# EAGLE design TinkerAccess RGB LED Driver (EAGLE 9.6.2)
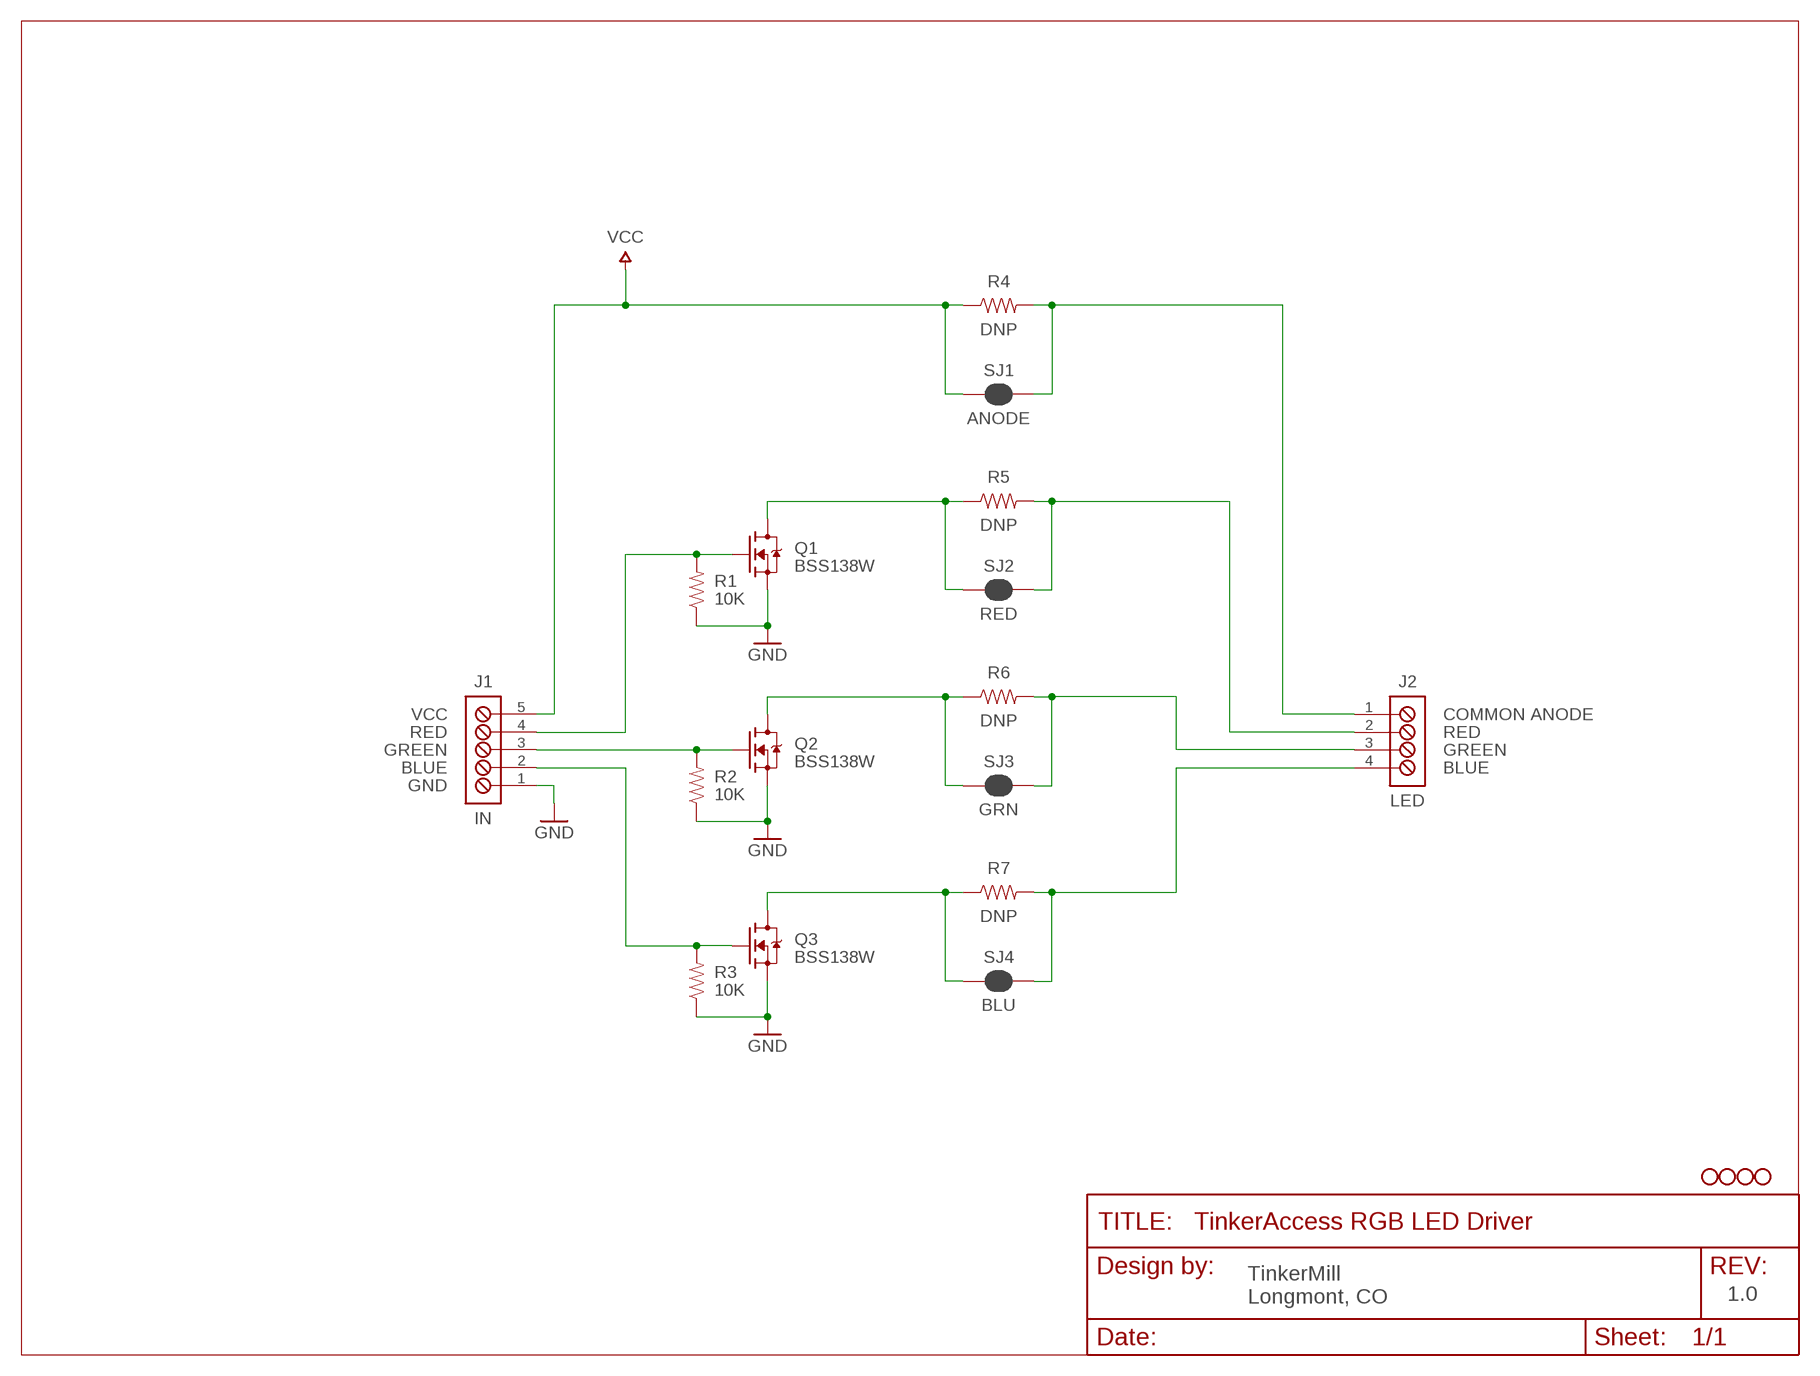
[diagram p0: schematic, sheet 1]

## Parts
J1  IN  TB_5X1_ON_SHORE_OSTVN05A150  [ON_SHORE_OSTVN05A150]
J2  LED  TB_4X1_ON_SHORE_OSTVN04A150  [ON_SHORE_OSTVN04A150]
Q1  BSS138W  N_MOSFET_BSS138W  [SOT323]
Q2  BSS138W  N_MOSFET_BSS138W  [SOT323]
Q3  BSS138W  N_MOSFET_BSS138W  [SOT323]
R1  10K  RESISTOR_0603  [0603]
R2  10K  RESISTOR_0603  [0603]
R3  10K  RESISTOR_0603  [0603]
R4  DNP  RESISTOR_0603  [0603]
R5  DNP  RESISTOR_0603  [0603]
R6  DNP  RESISTOR_0603  [0603]
R7  DNP  RESISTOR_0603  [0603]
SJ1  ANODE  JMP_PAD_2X1_CLOSED_BY_PASTE_NORMAL  [JMP_PAD_2X1_CLOSED_BY_PASTE]
SJ2  RED  JMP_PAD_2X1_CLOSED_BY_PASTE_NORMAL  [JMP_PAD_2X1_CLOSED_BY_PASTE]
SJ3  GRN  JMP_PAD_2X1_CLOSED_BY_PASTE_NORMAL  [JMP_PAD_2X1_CLOSED_BY_PASTE]
SJ4  BLU  JMP_PAD_2X1_CLOSED_BY_PASTE_NORMAL  [JMP_PAD_2X1_CLOSED_BY_PASTE]
STANDOFF1  STANDOFF_2.3MM_NO_CU  [STANDOFF_2.3MM_NO_CU]
STANDOFF2  STANDOFF_2.3MM_NO_CU  [STANDOFF_2.3MM_NO_CU]
STANDOFF3  STANDOFF_2.3MM_NO_CU  [STANDOFF_2.3MM_NO_CU]
STANDOFF4  STANDOFF_2.3MM_NO_CU  [STANDOFF_2.3MM_NO_CU]

## Nets
GND: J1.1 Q1.2(S) Q2.2(S) Q3.2(S) R1.1 R2.1 R3.1
N$1: J1.4 Q1.1(G) R1.2
N$2: J1.3 Q2.1(G) R2.2
N$3: J1.2 Q3.1(G) R3.2
N$4: J2.2 R5.2 SJ2.2
N$5: J2.3 R6.2 SJ3.2
N$6: J2.4 R7.2 SJ4.2
N$8: Q1.3(D) R5.1 SJ2.1
N$9: Q2.3(D) R6.1 SJ3.1
N$10: Q3.3(D) R7.1 SJ4.1
N$13: J2.1 R4.2 SJ1.2
VCC: J1.5 R4.1 SJ1.1

## Notes on the sheet
- VCC | COMMON ANODE
- RED | RED
- GREEN | GREEN
- BLUE | BLUE
- GND
- TinkerMill
  Longmont, CO
- 1.0

## Library data of the parts
J1 = TMF_Connectors:TB_5X1
J2 = TMF_Connectors:TB_4X1
Q1-Q3 = TMF_Discretes:N_MOSFET
R1-R7 = TMF_Resistors:RESISTOR
SJ1-SJ4 = TMF_Connectors:JMP_PAD_2X1_CLOSED_BY_PASTE
STANDOFF1-STANDOFF4 = TMF_Hardware:STANDOFF

## Board
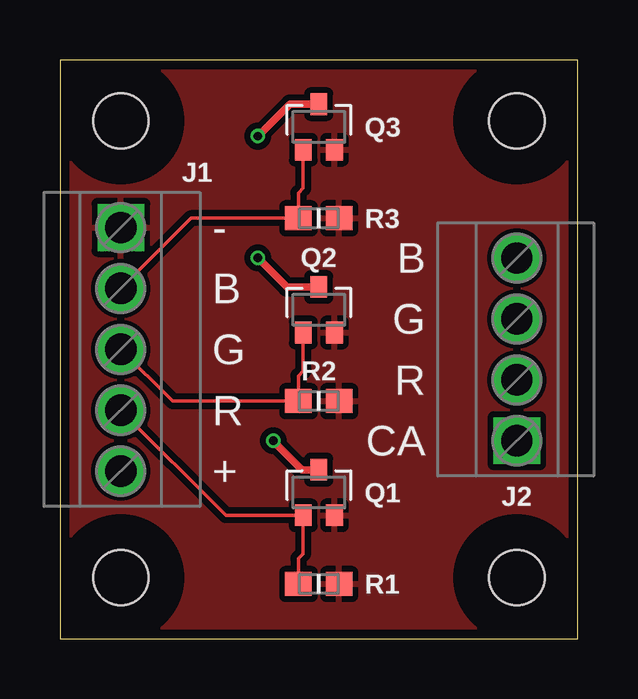
[diagram p1: board, top side]
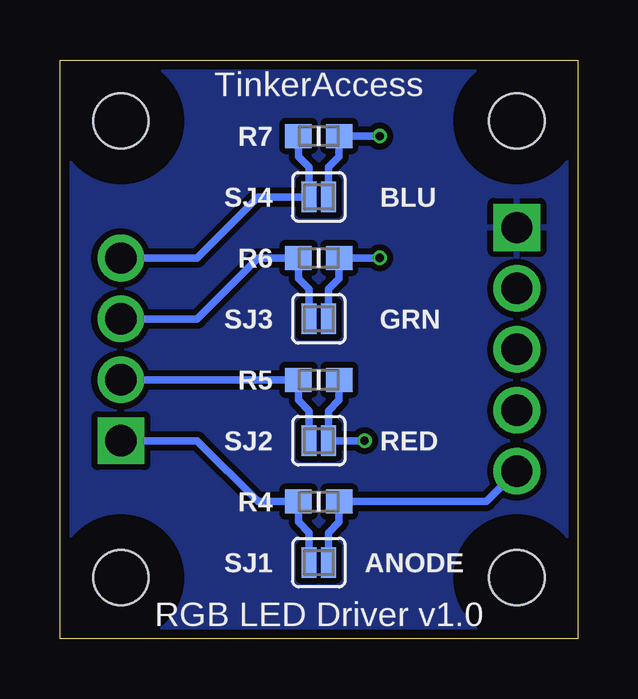
[diagram p2: board, bottom side, seen from below]

Size 21.59 x 24.13 mm. Coordinates in mm from the lower left corner, seen from the top.
Outline: 0,0 21.59,0 21.59,24.13 0,24.13 0,0
Copper layers (1*16): Top 0.035559375mm / dielectric 1.6mm / Bottom 0.035559375mm
Design rules "oshpark-2layer-tented": minimum track width 6mil, minimum drill 10mil, track to track 6mil, track to pad 6mil, pad to pad 6mil, via to via 6mil, smd to smd 6mil, copper to edge 15mil, drill to drill 6mil, minimum pad ring 5mil, minimum via ring 5mil, stop-mask expansion 2.5mil, vias tented up to drill 20mil, thermal gap 10mil

### Footprints (pad centres in the part's own frame; a part is rotated, then mirrored left to right if it is on the bottom)
ON_SHORE_OSTVN05A150 = drill 1.3 square: 1 0,5.08 | drill 1.3: 2 0,2.54; 3 0,0; 4 0,-2.54; 5 0,-5.08
ON_SHORE_OSTVN04A150 = drill 1.3 square: 1 0,3.81 | drill 1.3: 2 0,1.27; 3 0,-1.27; 4 0,-3.81
SOT323 = smd 0.7 x 0.9: 1 -0.65,-0.95; 2 0.65,-0.95; 3 0,0.95
0603 = smd 1.1 x 1: 1 -0.85,0; 2 0.85,0
JMP_PAD_2X1_CLOSED_BY_PASTE = smd 0.635 x 1.27: 1 -0.406,0; 2 0.406,0
STANDOFF_2.3MM_NO_CU = hole 2.3: 0,0

### Placement (x,y rotation side)
J1  2.54,12.06 0 top
J2  19.05,12.06 180 top
Q1  10.79,6.1 0 top
Q2  10.79,13.72 0 top
Q3  10.79,21.34 0 top
R1  10.79,2.29 180 top
R2  10.79,9.91 180 top
R3  10.79,17.53 180 top
R4  10.79,5.71 180 bottom
R5  10.79,10.79 180 bottom
R6  10.79,15.88 180 bottom
R7  10.79,20.95 180 bottom
SJ1  10.79,3.17 180 bottom
SJ2  10.79,8.26 180 bottom
SJ3  10.79,13.34 180 bottom
SJ4  10.79,18.41 180 bottom
STANDOFF1  2.54,2.54 0 top
STANDOFF2  2.54,21.59 0 top
STANDOFF3  19.05,21.59 0 top
STANDOFF4  19.05,2.54 0 top

### Tracks (layer width: path | path; a pad name or v marks a point on that pad's centre or on a via)
GND
  pour Top (isolate 0.254): 0,0 0,24.13 21.59,24.13 21.59,0
  pour Bottom (isolate 0.254, rank 2): 0,0 0,24.13 21.59,24.13 21.59,0
N$1
  Top 0.152: J1.4 6.92,5.15 Q1.1 10.14,3.54 9.95,3.34 R1.2
N$2
  Top 0.152: J1.3 4.7,9.91 R2.2 9.95,10.96 10.14,11.16 Q2.1
N$3
  Top 0.152: J1.2 5.46,17.53 R3.2 9.95,18.58 10.14,18.78 Q3.1
N$4
  Bottom 0.305: J2.2 R5.2 11.64,9.95 11.2,9.5 SJ2.2
N$5
  Bottom 0.305: SJ3.2 11.2,14.58 11.64,15.03 R6.2 13.34,15.88 15.88,13.34 J2.3
N$6
  Bottom 0.305: R7.2 11.64,20.11 11.2,19.66 SJ4.2 13.34,18.41 15.88,15.88 J2.4
N$8  (via drill 0.35)
  Top 0.305: Q1.3 10.1,7.05 v8.89,8.26
  Bottom 0.305: v8.89,8.26 SJ2.1 10.39,9.5 9.95,9.95 R5.1
N$9  (via drill 0.35)
  Top 0.305: Q2.3 9.46,14.67 v8.26,15.88
  Bottom 0.305: v8.26,15.88 R6.1 9.95,15.03 10.39,14.58 SJ3.1
N$10  (via drill 0.35)
  Top 0.305: Q3.3 9.59,22.29 v8.26,20.95
  Bottom 0.305: v8.26,20.95 R7.1 9.95,20.11 10.39,19.66 SJ4.1
N$13
  Bottom 0.305: SJ1.2 11.2,4.42 11.64,4.87 R4.2 13.34,5.71 15.88,8.26 J2.1
VCC
  Bottom 0.305: J1.5 3.81,5.71 R4.1 9.95,4.87 10.39,4.42 SJ1.1

### Text on the board
bPlace: TinkerAccess | RGB LED Driver v1.0
tNames: - | B | B | G | G | R | R | CA | +